# EAGLE schematic Complete (EAGLE 9.6.2)
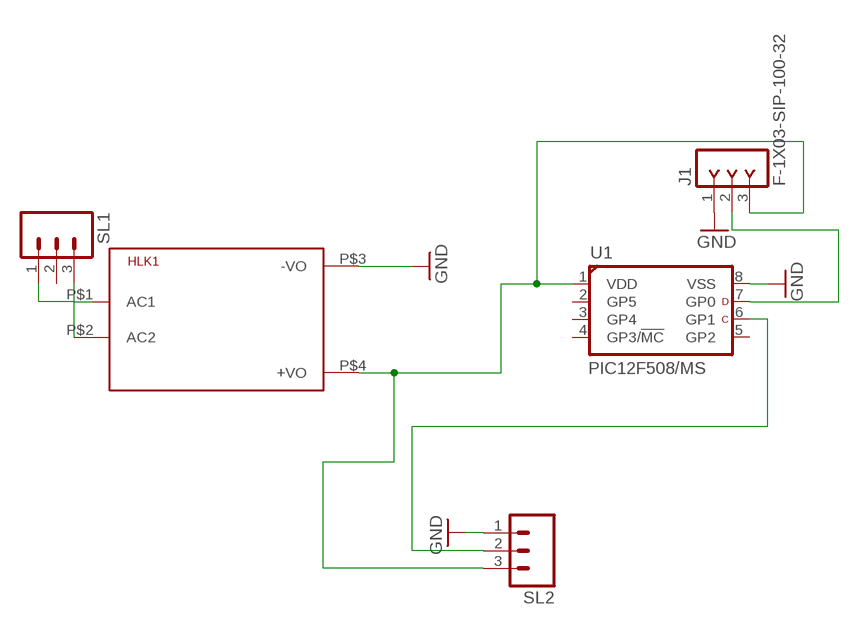
[diagram p0: schematic, sheet 1]

## Parts
HLK1  HLK-PM013W  [HLK-PM01]
J1  F-1X03-SIP-100-32  [SIP-100-03-32]
SL1  M03  [03P]
SL2  M03  [03P]
U1  PIC12F508/MS  [MSOP8-MS]

## Nets
GND: HLK1.P$3(-VO) J1.1 SL2.1 U1.8(VSS)
N$1: J1.2 U1.7(GP0)
N$3: SL2.2 U1.6(GP1)
N$4: HLK1.P$1(AC1) SL1.1
N$5: HLK1.P$2(AC2) SL1.3
N$6: HLK1.P$4(+VO) J1.3 SL2.3 U1.1(VDD)
Unconnected: SL1.2 U1.2(GP5) U1.3(GP4) U1.4(GP3/!MC!) U1.5(GP2)

## Library data of the parts
HLK1 = HLK-PM01:HLK-PM01: Hi-Link Power Supply HLK-PM01 3W Author: Ahmed Said <https://github.com/AhmedSaid/EAGLELibraries>
J1 = con-headers-jp:F-1X03-: FEMALE HEADER
SL1 SL2 = con-amp-quick:M03: AMP QUICK CONNECTOR; OC_FARNELL: unknown; OC_NEWARK: unknown
U1 = microchip_pic12f:PIC12F508: Low pincount microcontroller http://www.microchip.com/wwwproducts/Devices.aspx?product=PIC12F508 Properties Parameter Name Value Program Memory Type Flash Program Memory (KB) 0.75 CPU Speed (MIPS) 1 RAM Bytes 25 Timers 1 x 8-bit Temperature Range (C) -40 to 125 Operating Voltage Range (V) 2 to 5.5 Pin Count 8 Features Precision 4 MHz internal oscillator Baseline Core with 33 Instructions, 2 Stack Levels All single-cycle Instructions except for program branches which are two cycles 12-bit wide instructions 8-bit wide data path 25 mA source/sink current I/O Low power (100nA) sleep current One 8-bit timer (TMR0) Watchdog timer (WDT) In Circuit Serial Programming™ (ICSP™) capability In-Circuit debugging support Programmable code protection Library from www.mikroelektroniikka.fi/lbr